# EasyEDA schematic grid_display.json
TITLE: Sheet_1; REV: 1.0; Date: 2021-04-11; Sheet: 1/1; Drawn By: hotspaghetti; Company: Your Company
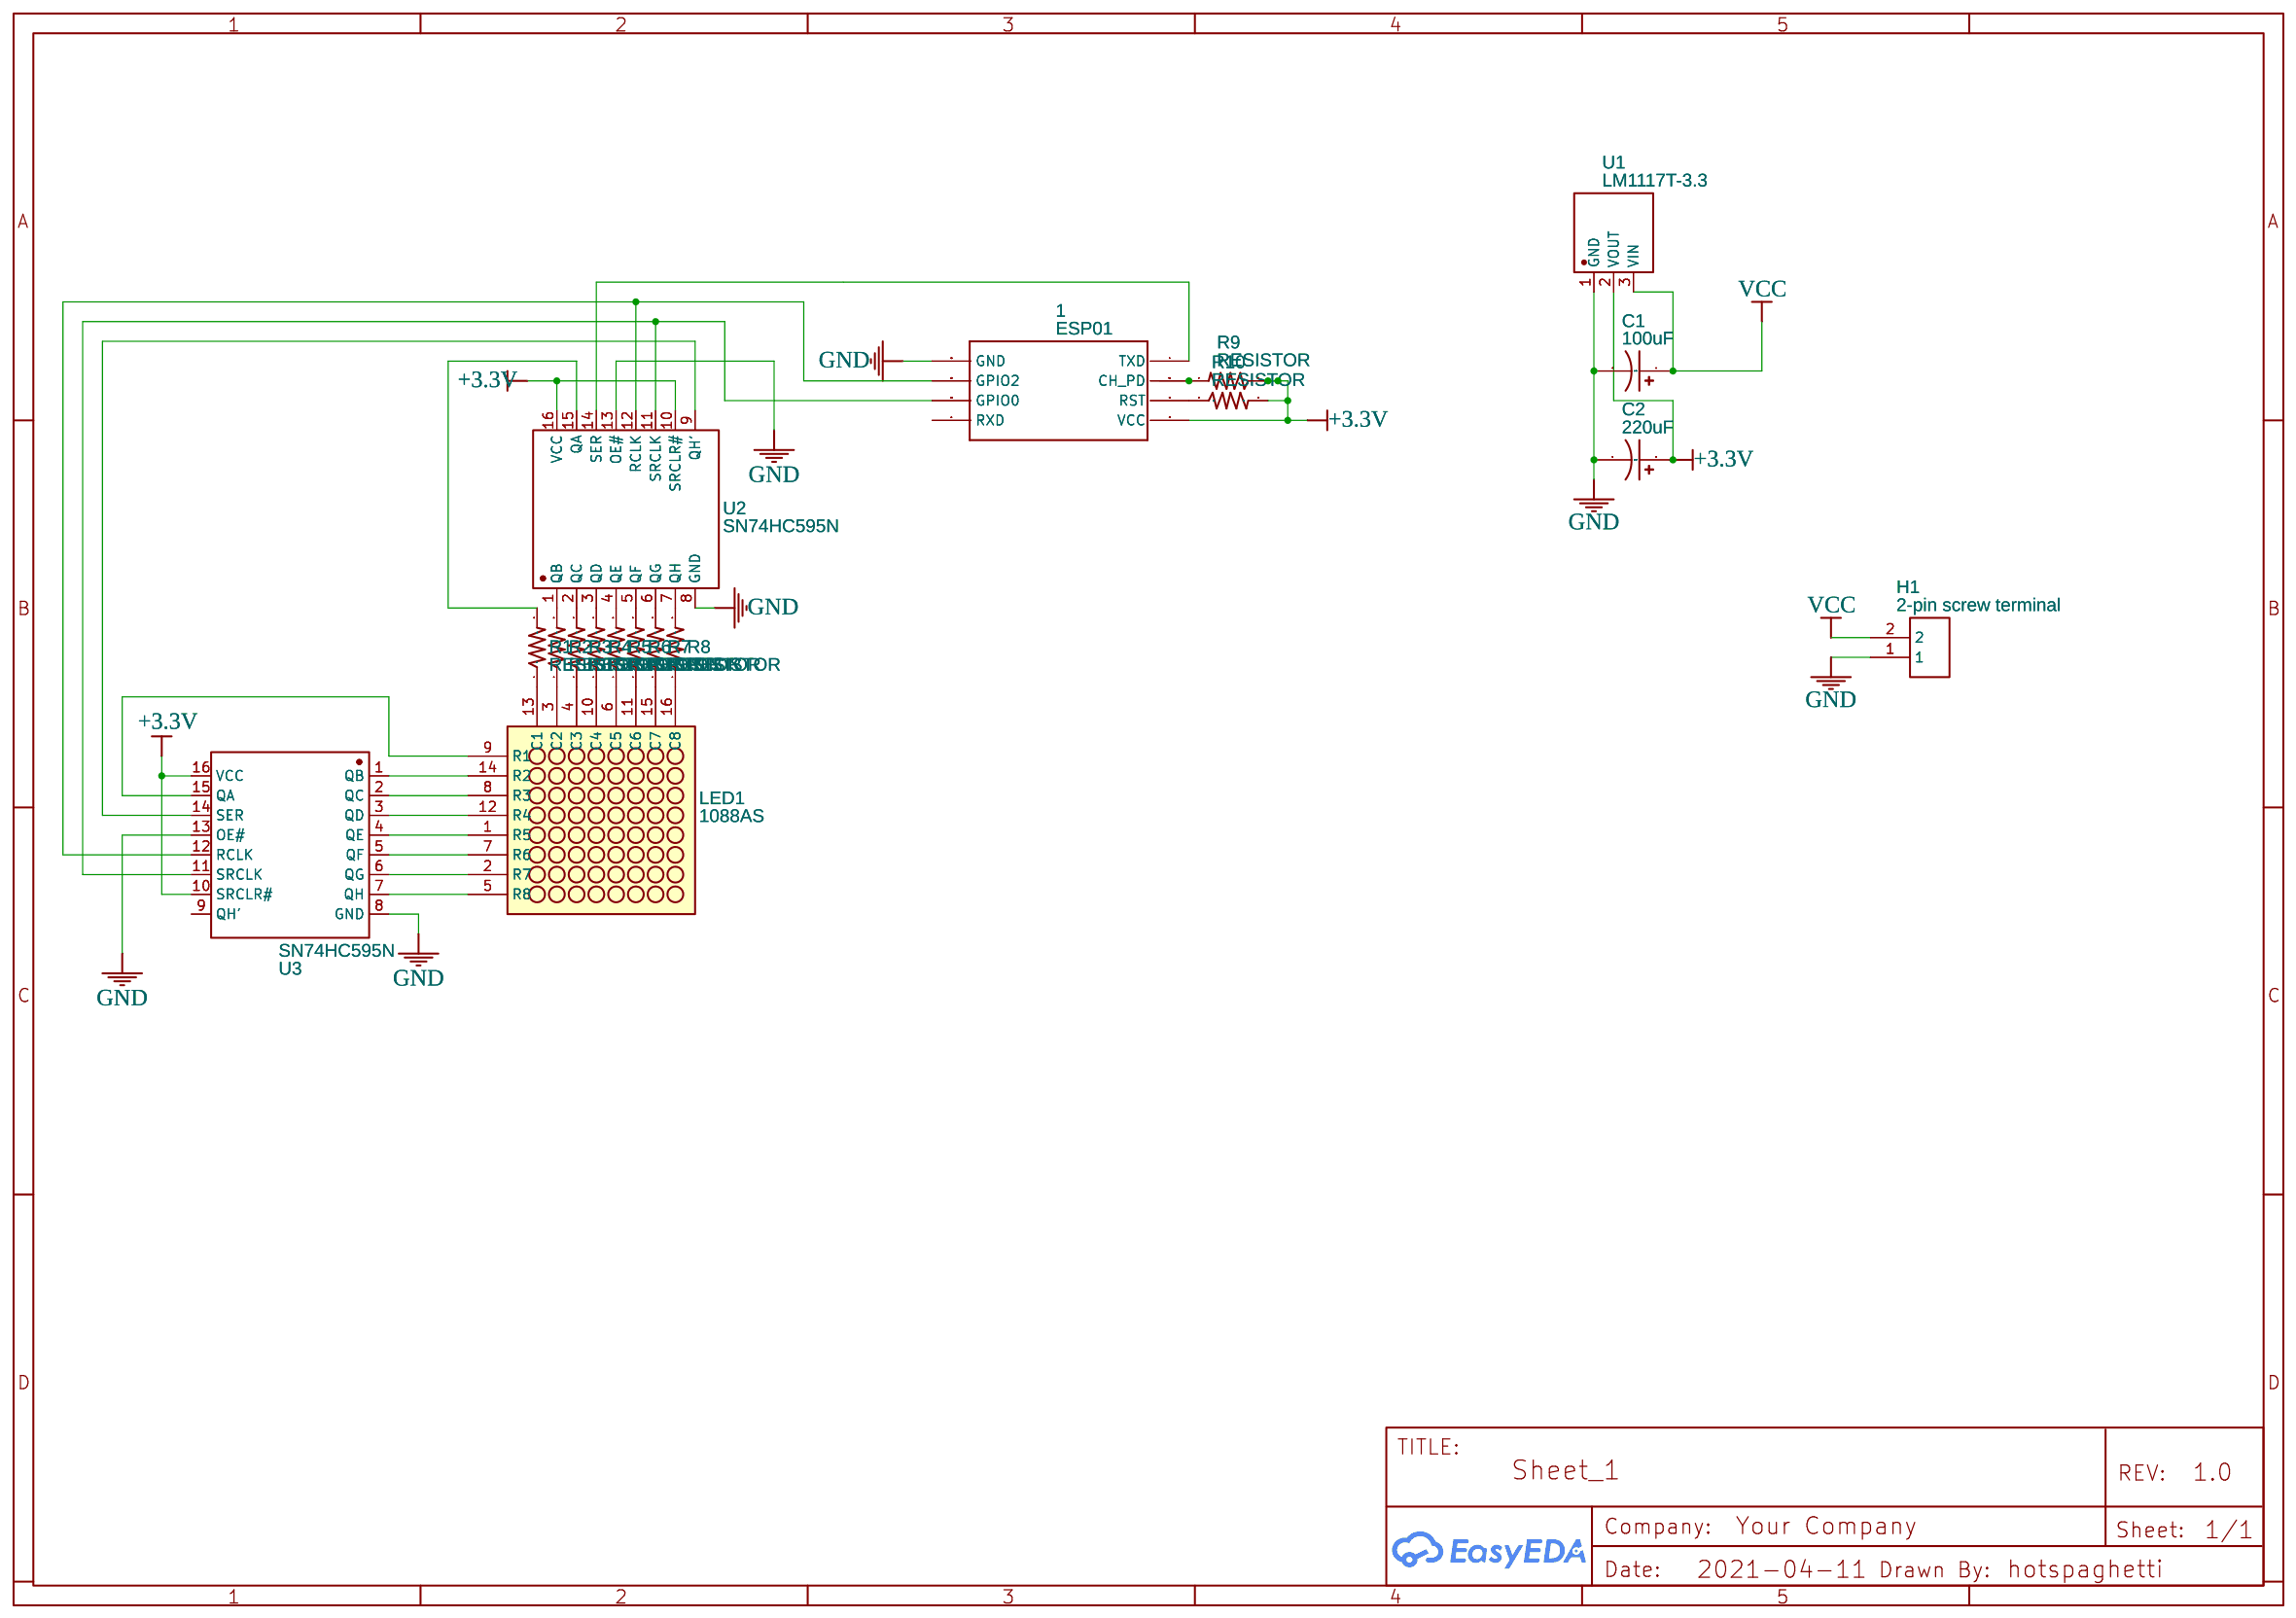
[diagram p0: schematic sheet]

## Parts
1  ESP01  [ESP01]
C1  100uF  [CAP-D10.0×F5.0]
C2  220uF  [CAP-D10.0×F5.0]
H1  2-pin screw terminal  [2-PIN SCREW TERMINAL]
LED1  1088AS  [LED-LED-8*8-32*32]
R1  RESISTOR  [PR-RES-1/4W]
R2  RESISTOR  [PR-RES-1/4W]
R3  RESISTOR  [PR-RES-1/4W]
R4  RESISTOR  [PR-RES-1/4W]
R5  RESISTOR  [PR-RES-1/4W]
R6  RESISTOR  [PR-RES-1/4W]
R7  RESISTOR  [PR-RES-1/4W]
R8  RESISTOR  [PR-RES-1/4W]
R9  RESISTOR  [PR-RES-1/4W]
R10  RESISTOR  [PR-RES-1/4W]
U1  LM1117T-3.3  [TO-220-3_L10.0-W4.5-P2.54-L]
U2  SN74HC595N  [DIP-16_L19.8-W6.5-P2.54-LS7.6-BL]
U3  SN74HC595N  [DIP-16_L19.8-W6.5-P2.54-LS7.6-BL]

## Library data of the parts
1 = ESP01: Contributor: AlexeyRUS
C1 C2 = CE_TH_D10.0×F5.0_US: Contributor: LCEDA_Lib
H1 = 2-pin screw terminal: Contributor: MeItIs
LED1 = 1088AS: Manufacturer: ReliaPro; Manufacturer Part: 8X8LEDLED dots 3.0mmPoint path red; Supplier Part: C10524; Contributor: Yongmin Kim
R1-R10 = RESISTOR
U1 = LM1117T-3.3: Supplier: LCSC; Supplier Part: C498321; Manufacturer: HGSEMI; Contributor: LCSC; LCSC Assembly: Yes; SMT Type: Extend; Paste Type: expand
U2 U3 = SN74HC595N: Supplier: LCSC; Manufacturer: TI; image: //image.lceda.cn/szlcsc/C78711.jpg; Supplier Part: C78711

## Nets
+3.3V: 1.VCC C2.1 R9.1 R10.2 U1.2(VOUT) U2.10(SRCLR#) U2.16(VCC) U3.10(SRCLR#) U3.16(VCC)
GND: 1.GND C1.2 C2.2 H1.1 U1.1(GND) U2.8(GND) U2.13(OE#) U3.8(GND) U3.13(OE#)
VCC: C1.1 H1.2 U1.3(VIN)
Net-(1-CH_PD): 1.CH_PD R9.2
Net-(1-GPIO0): 1.GPIO0 U2.11(SRCLK) U3.11(SRCLK)
Net-(1-GPIO2): 1.GPIO2 U2.12(RCLK) U3.12(RCLK)
Net-(1-RST): 1.RST R10.1
Net-(1-TX): 1.TX(TXD) U2.14(SER)
Net-(LED1-1): LED1.1(R5) U3.4(QE)
Net-(LED1-2): LED1.2(R7) U3.6(QG)
Net-(LED1-3): LED1.3(C2) R2.1
Net-(LED1-4): LED1.4(C3) R3.1
Net-(LED1-5): LED1.5(R8) U3.7(QH)
Net-(LED1-6): LED1.6(C5) R5.1
Net-(LED1-7): LED1.7(R6) U3.5(QF)
Net-(LED1-8): LED1.8(R3) U3.2(QC)
Net-(LED1-9): LED1.9(R1) U3.15(QA)
Net-(LED1-10): LED1.10(C4) R4.1
Net-(LED1-11): LED1.11(C6) R6.1
Net-(LED1-12): LED1.12(R4) U3.3(QD)
Net-(LED1-13): LED1.13(C1) R1.1
Net-(LED1-14): LED1.14(R2) U3.1(QB)
Net-(LED1-15): LED1.15(C7) R7.1
Net-(LED1-16): LED1.16(C8) R8.1
Net-(R1-2): R1.2 U2.15(QA)
Net-(R2-2): R2.2 U2.1(QB)
Net-(R3-2): R3.2 U2.2(QC)
Net-(R4-2): R4.2 U2.3(QD)
Net-(R5-2): R5.2 U2.4(QE)
Net-(R6-2): R6.2 U2.5(QF)
Net-(R7-2): R7.2 U2.6(QG)
Net-(R8-2): R8.2 U2.7(QH)
Net-(U2-9): U2.9(QH') U3.14(SER)

Not connected (* = marked no-connect by the designer): 1 RX(RXD); U3 9(QH')
